# Altium schematic sheet Sheet1.SchDoc
size A4
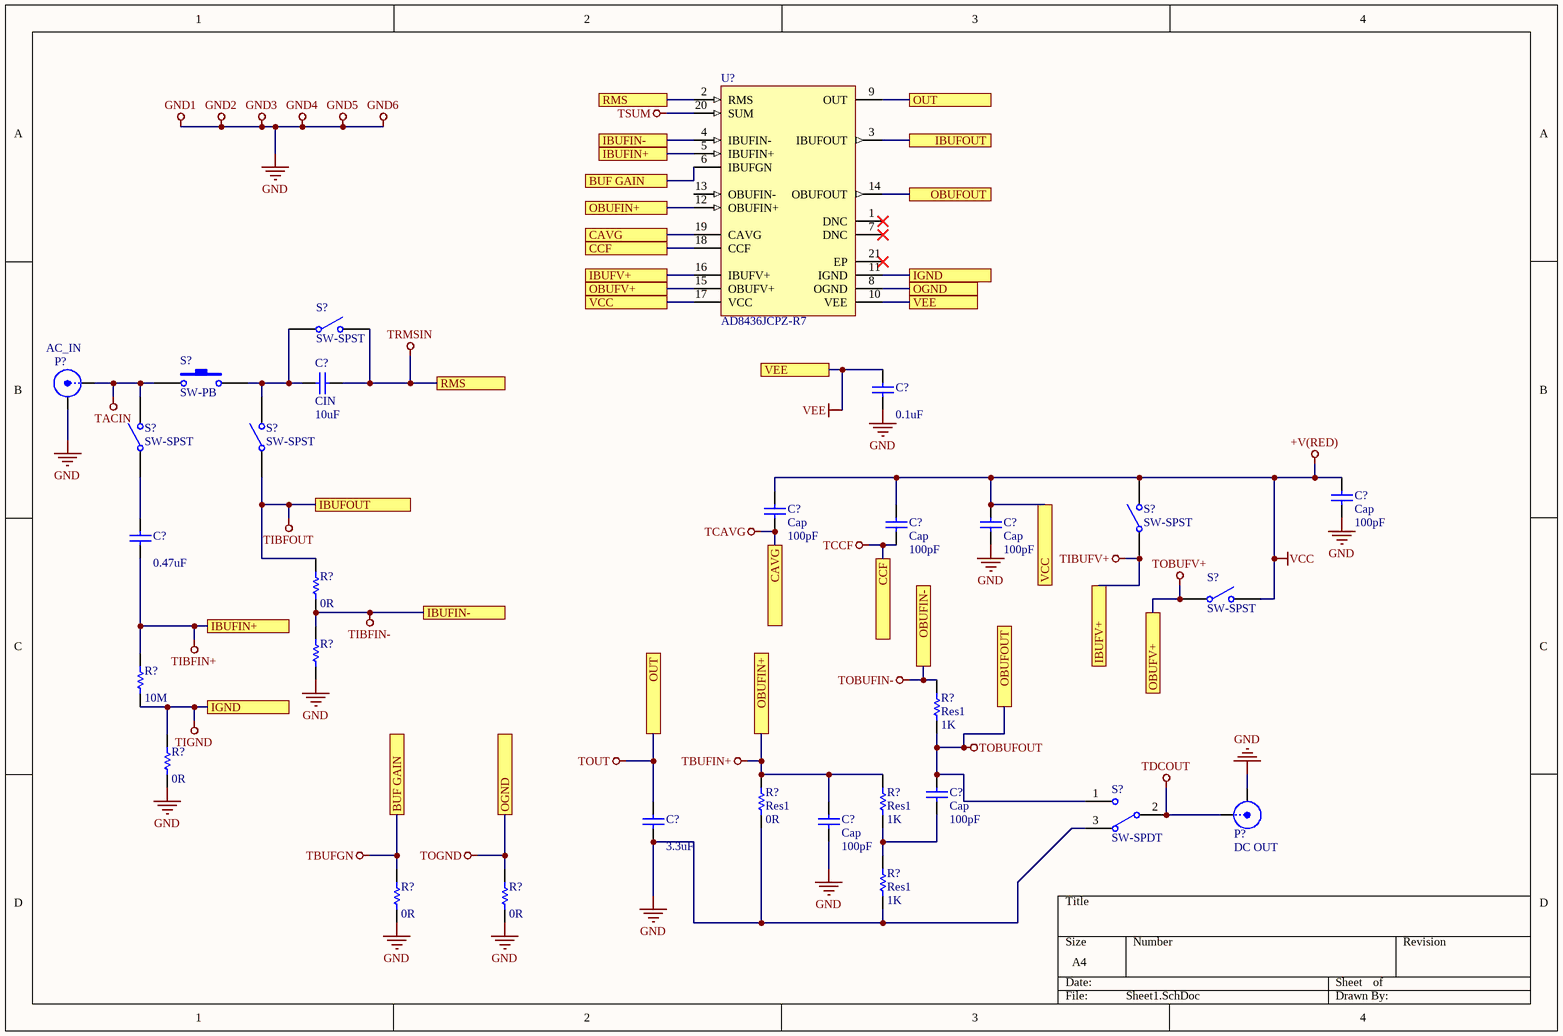
[diagram p0: Sheet1.SchDoc]

## Parts
(Parts that share a designator on the sheet are numbered #1, #2 ... from top to bottom, then left to right.)
C?#1  CIN  value 10uF  [RAD-0.3]
C?#2  value 0.1uF  [RAD-0.3]  (hidden comment: Cap)
C?#3  Cap  value 100pF  [RAD-0.3]
C?#4  Cap  value 100pF  [RAD-0.3]
C?#5  Cap  value 100pF  [RAD-0.3]
C?#6  Cap  value 100pF  [RAD-0.3]
C?#7  value 0.47uF  [RAD-0.3]  (hidden comment: Cap)
C?#8  Cap  value 100pF  [RAD-0.3]
C?#9  value 3.3uF  [RAD-0.3]  (hidden comment: Cap)
C?#10  Cap  value 100pF  [RAD-0.3]
P?#1  AC_IN  [BNC_RA CON]
P?#2  DC OUT  [SMB_V-RJ45]
R?#1  value 0R  [AXIAL-0.3]  (hidden comment: Res1)
R?#2  Res1  [AXIAL-0.3]  (value not drawn)
R?#3  value 10M  [AXIAL-0.3]  (hidden comment: R1)
R?#4  Res1  value 1K  [AXIAL-0.3]
R?#5  value 0R  [AXIAL-0.3]  (hidden comment: R6)
R?#6  Res1  value 0R  [AXIAL-0.3]
R?#7  Res1  value 1K  [AXIAL-0.3]
R?#8  Res1  value 1K  [AXIAL-0.3]
R?#9  value 0R  [AXIAL-0.3]  (hidden comment: Res1)
R?#10  value 0R  [AXIAL-0.3]  (hidden comment: Res1)
S?#1  SW-SPST  [SPST-2]
S?#2  SW-PB  [SPST-2]
S?#3  SW-SPST  [SPST-2]
S?#4  SW-SPST  [SPST-2]
S?#5  SW-SPST  [SPST-2]
S?#6  SW-SPST  [SPST-2]
S?#7  SW-SPDT  [TL36WW15050]
U?  AD8436JCPZ-R7  [ADI-CP-20-10_N]

## Ports
BUF GAIN, CAVG, CCF, IBUFIN+, IBUFIN-, IBUFOUT, IBUFV+, IGND, OBUFIN+, OBUFIN-, OBUFOUT, OBUFV+, OGND, OUT, RMS, VCC, VEE

## Nets
+V(RED): C?#3.2 C?#4.2 C?#5.2 C?#6.2 S?#5.2(NO) S?#6.2(NO) U?.17(VCC) ; port VCC  [also labelled VCC]
GND: C?#2.1 C?#3.1 C?#6.1 C?#9.1 C?#10.1 P?#1.2(Y) P?#2.2(Y) R?#2.1 R?#5.1 R?#6.1 R?#8.1 R?#9.1 R?#10.1 S?#7.3  [also labelled GND1, GND2, GND3, GND4, GND5, GND6]
TACIN: P?#1.1(X) S?#2.1 S?#3.2(NO)
TBUFGN: R?#9.2 U?.6(IBUFGN) ; port BUF GAIN
TBUFIN+: C?#10.2 R?#6.2 R?#7.2 U?.12(OBUFIN+) ; port OBUFIN+
TCAVG: C?#4.1 U?.19(CAVG) ; port CAVG
TCCF: C?#5.1 U?.18(CCF) ; port CCF
TDCOUT: P?#2.1(X) S?#7.2
TIBFIN+: C?#7.1 R?#3.2 U?.5(IBUFIN+) ; port IBUFIN+
TIBFIN-: R?#1.1 R?#2.2 U?.4(IBUFIN-) ; port IBUFIN-
TIBFOUT: R?#1.2 S?#4.1(COMMON) U?.3(IBUFOUT) ; port IBUFOUT
TIBUFV+: S?#5.1(COMMON) U?.16(IBUFV+) ; port IBUFV+
TIGND: R?#3.1 R?#5.2 U?.11(IGND) ; port IGND
TOBUFIN-: R?#4.2 ; port OBUFIN-
TOBUFOUT: C?#8.2 R?#4.1 S?#7.1 U?.14(OBUFOUT) ; port OBUFOUT
TOBUFV+: S?#6.1(COMMON) U?.15(OBUFV+) ; port OBUFV+
TOGND: R?#10.2 U?.8(OGND) ; port OGND
TOUT: C?#9.2 U?.9(OUT) ; port OUT
TRMSIN: C?#1.2 S?#1.2(NO) U?.2(RMS) ; port RMS
TSUM: U?.20(SUM)
VEE: C?#2.2 U?.10(VEE) ; port VEE
NetC?#1_1: C?#1.1 S?#1.1(COMMON) S?#2.2 S?#4.2(NO)
NetC?#7_2: C?#7.2 S?#3.1(COMMON)
NetC?#8_1: C?#8.1 R?#7.1 R?#8.2

Not connected (* = marked no-connect by the designer): U? 1(DNC)* 7(DNC)* 13(OBUFIN-) 21(EP)*

## Library data of the parts
C?#1-C?#10 = Cap: Capacitor; Published: 8-Jun-2000; LatestRevisionDate: 17-Jul-2002; LatestRevisionNote: Re-released for DXP Platform.; PackageReference: RAD-0.3; Publisher: Altium Limited; PackageDescription: Radial Cap, Thru-Hole; 2 Leads; 0.3 in Pin Spacing
P?#1 = BNC: BNC Elbow Connector; LatestRevisionDate: 17-Jul-2002; LatestRevisionNote: Re-released for DXP Platform.; Publisher: Altium Limited
P?#2 = SMB: SMB Straight Connector; LatestRevisionDate: 17-Jul-2002; LatestRevisionNote: Re-released for DXP Platform.; Publisher: Altium Limited
R?#1-R?#10 = Res1: Resistor; Published: 8-Jun-2000; LatestRevisionDate: 17-Jul-2002; LatestRevisionNote: Re-released for DXP Platform.; PackageReference: AXIAL-0.3; Publisher: Altium Limited; PackageDescription: Axial Device, Thru-Hole; 2 Leads; 0.3 in Pin Spacing
S?#1 S?#3-S?#6 = SW-SPST: Single-Pole, Single-Throw Switch; Published: 24-Mar-1999; LatestRevisionDate: 17-Jul-2002; LatestRevisionNote: Re-released for DXP Platform.; PackageReference: SPST-2; Publisher: Altium Limited; PackageDescription: Switch; 2 Leads
S?#2 = SW-PB: Switch; Published: 24-Mar-1999; LatestRevisionDate: 17-Jul-2002; LatestRevisionNote: Re-released for DXP Platform.; PackageReference: SPST-2; Publisher: Altium Limited; PackageDescription: Switch; 2 Leads
S?#7 = SW-SPDT: SPDT Subminiature Toggle Switch, Right Angle Mounting, Vertical Actuation; Published: 24-Mar-1999; LatestRevisionDate: 17-Dec-2003; LatestRevisionNote: Schematic revised, PCB Footprint replaced.; DatasheetVersion: 05-Dec-2000; PackageReference: TL36WW15050; Publisher: Altium Limited; PackageDescription: Switch; 4 Leads; ComponentLink1Description: Manufacturer Link; ComponentLink1URL: http://www.apem.com
U? = CMP-0527-00006-3: Low Cost, Low Power, True RMS-to-DC Converter, 4.8 to 36 V Single Supply, 0 to 70 degC, 20-Pin QFN (CP-20-10); Manufacturer: Analog Devices; V Span (min): 4.8 V; Max Vin (V-rms): 3 V rms; Error (%@ CF: 3)=0.5; V Span (max): 36 V; -3dB Bandwidth: 950 KHz; Supply Current: 300 uA; PartNumber: AD8436JCPZ-R7; ComponentLink2Description: Datasheet; PackageDescription: 20-Pin Frame Chip Scale Package, Body 4 x 4 mm, Pitch 0.5 mm; ComponentLink3Description: Package Specification; PackageReference: CP-20-10; PackageVersion: Rev. B; ComponentLink1URL: http://www.analog.com/; RoHS: TRUE; DatasheetVersion: Rev. B; ComponentLink1Description: Manufacturer URL; ComponentLink3URL: http://www.analog.com/static/imported-files/packages/PKG_PDF/LFCSP(CP)/CP_20_10.pdf; Mounting Technology: Surface Mount; ComponentLink2URL: http://www.analog.com/static/imported-files/data_sheets/AD8436.pdf; Operating Temperature Range: 0 to 70 degC